# Altium schematic sheet CH579M-R1.SchDoc
size 304 x 228 mm
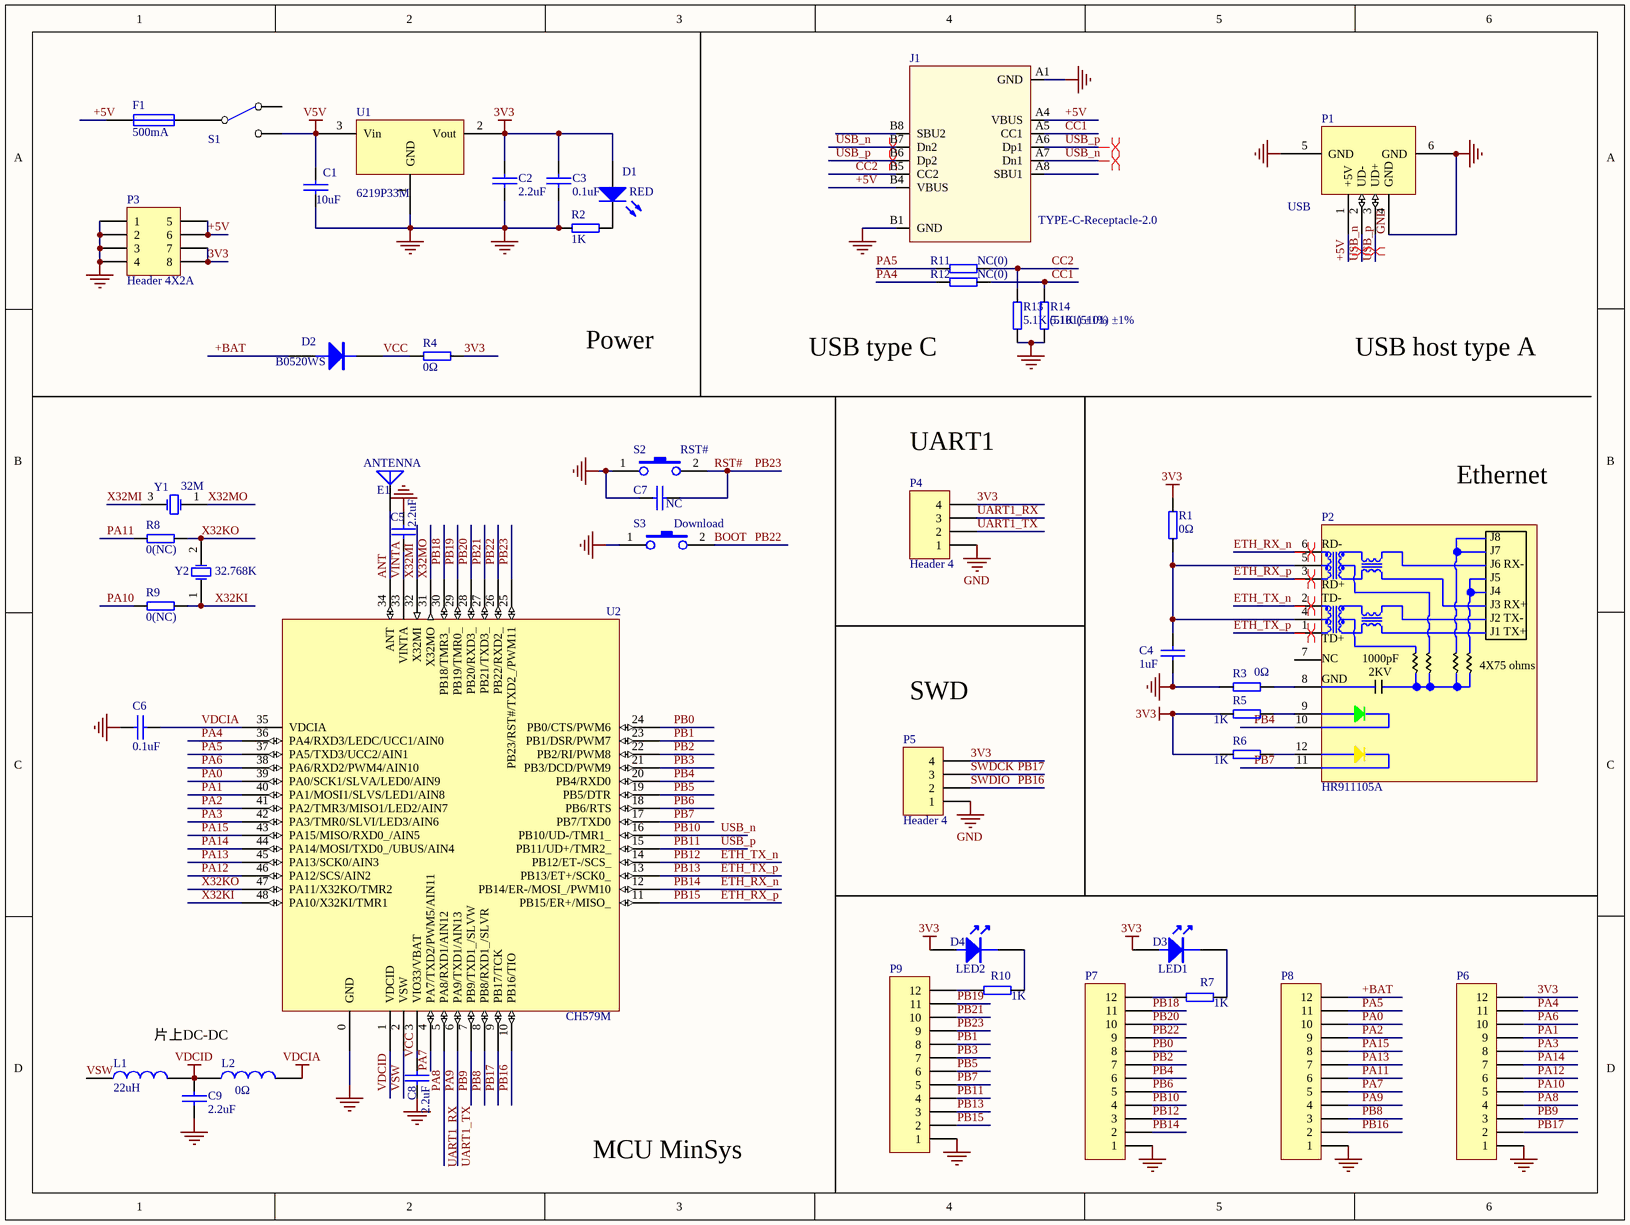
[diagram p0: CH579M-R1.SchDoc]

## Parts
C1  10uF  [3216]
C2  2.2uF  [0603]
C3  0.1uF  [0603]
C4  1uF  [0603]
C5  2.2uF  [0603]
C6  0.1uF  [0603]
C7  NC  [0603]
C8  2.2uF  [0603]
C9  2.2uF  [0603]
D1  RED  [0603+]
D2  B0520WS  [SOD323]
D3  LED1  [0603+]
D4  LED2  [0603+]
E1  ANTENNA  [ANT-F-1-2.4G-1.6]
F1  500mA  [0805]
J1  TYPE-C-Receptacle-2.0  [TYPE-C-Receptacle-2.0]
L1  22uH  [SMD-2.5*2*1.05]
L2  0Ω  [0603]
P1  USB  [USBA-L]
P2  HR911105A  [HR911105A]
P3  Header 4X2A  [IDC8]
P4  Header 4  [HDR1X4]
P5  Header 4  [HDR1X4]
P6  Header 12  [SIP12 - 40mil]  (value not drawn)
P7  Header 12  [SIP12 - 40mil]  (value not drawn)
P8  Header 12  [SIP12 - 40mil]  (value not drawn)
P9  Header 12  [SIP12 - 40mil]  (value not drawn)
R1  0Ω  [0603]
R2  1K  [0603]
R3  0Ω  [0603]
R4  0Ω  [0603]
R5  1K  [0603]
R6  1K  [0603]
R7  1K  [0603]
R8  0(NC)  [0603]
R9  0(NC)  [0603]
R10  1K  [0603]
R11  NC(0)  [0603]
R12  NC(0)  [0603]
R13  5.1K (5101) ±1%  [0603]
R14  5.1K (5101) ±1%  [0603]
S1  SW SPDT  [KEY_B]  (value not drawn)
S2  RST#  [SMD_6.1x3.65x2.5mm-KEY]
S3  Download  [SMD_6.1x3.65x2.5mm-KEY]
U1  6219P33M  [SOT-23]
U2  CH579M  [QFN48_5X5]
Y1  32M  [3225]
Y2  32.768K  [fc-135]

## Nets
3V3: C2.1 C3.1 D1.1(A) D3.1 D4.1 P3.7 P3.8 P4.4 P5.4 P6.12 R1.2 R4.1 R5.1 R6.1 U1.2(Vout)
GND: C1.2 C2.2 C3.2 C4.1 C5.2 C6.2 C7.1 C8.1 C9.1 J1.A1(GND) J1.B1(GND) P1.4(GND) P1.5(GND) P1.6(GND) P3.1 P3.2 P3.3 P3.4 P4.1 P5.1 P6.1 P7.1 P8.1 P9.1 R2.2 R3.1 R13.2 R14.2 S2.1 S3.1 U1.1(GND) U2.0(GND)
V5V: C1.1 S1.2(NC) U1.3(Vin)
VDCIA: C6.1 L2.2 U2.35(VDCIA)
VDCID: C9.2 L1.2 L2.1 U2.1(VDCID)
+5V: F1.1 J1.A4(VBUS) J1.B4(VBUS) P1.1(+5V) P3.5 P3.6
+BAT: D2.1(A) P8.12
ANT: E1.1(A) U2.34(ANT)
BOOT: P7.9 S3.2 U2.26(PB22/RXD2_)  [also labelled PB22]
CC1: J1.A5(CC1) R12.2 R14.1
CC2: J1.B5(CC2) R11.2 R13.1
ETH_RX_n: P2.6 P7.2 U2.12(PB14/ER-/MOSI_/PWM10)  [also labelled PB14]
ETH_RX_p: P2.3 P9.2 U2.11(PB15/ER+/MISO_)  [also labelled PB15]
ETH_TX_n: P2.2 P7.3 U2.14(PB12/ET-/SCS_)  [also labelled PB12]
ETH_TX_p: P2.1 P9.3 U2.13(PB13/ET+/SCK0_)  [also labelled PB13]
PA0: P8.10 U2.39(PA0/SCK1/SLVA/LED0/AIN9)
PA1: P6.9 U2.40(PA1/MOSI1/SLVS/LED1/AIN8)
PA2: P8.9 U2.41(PA2/TMR3/MISO1/LED2/AIN7)
PA3: P6.8 U2.42(PA3/TMR0/SLVI/LED3/AIN6)
PA4: P6.11 R12.1 U2.36(PA4/RXD3/LEDC/UCC1/AIN0)
PA5: P8.11 R11.1 U2.37(PA5/TXD3/UCC2/AIN1)
PA6: P6.10 U2.38(PA6/RXD2/PWM4/AIN10)
PA7: P8.5 U2.4(PA7/TXD2/PWM5/AIN11)
PA8: P4.3 P6.4 U2.5(PA8/RXD1/AIN12)  [also labelled UART1_RX]
PA9: P4.2 P8.4 U2.6(PA9/TXD1/AIN13)  [also labelled UART1_TX]
PA10: P6.5 R9.1
PA11: P8.6 R8.1
PA12: P6.6 U2.46(PA12/SCS/AIN2)
PA13: P8.7 U2.45(PA13/SCK0/AIN3)
PA14: P6.7 U2.44(PA14/MOSI/TXD0_/UBUS/AIN4)
PA15: P8.8 U2.43(PA15/MISO/RXD0_/AIN5)
PB0: P7.8 U2.24(PB0/CTS/PWM6)
PB1: P9.8 U2.23(PB1/DSR/PWM7)
PB2: P7.7 U2.22(PB2/RI/PWM8)
PB3: P9.7 U2.21(PB3/DCD/PWM9)
PB4: P2.10 P7.6 U2.20(PB4/RXD0)
PB5: P9.6 U2.19(PB5/DTR)
PB6: P7.5 U2.18(PB6/RTS)
PB7: P2.11 P9.5 U2.17(PB7/TXD0)
PB8: P8.3 U2.8(PB8/RXD1_/SLVR)
PB9: P6.3 U2.7(PB9/TXD1_/SLVW)
PB10: J1.A7(Dn1) J1.B7(Dn2) P1.2(UD-) P7.4 U2.16(PB10/UD-/TMR1_)  [also labelled USB_n]
PB11: J1.A6(Dp1) J1.B6(Dp2) P1.3(UD+) P9.4 U2.15(PB11/UD+/TMR2_)  [also labelled USB_p]
PB16: P5.2 P8.2 U2.10(PB16/TIO)  [also labelled SWDIO]
PB17: P5.3 P6.2 U2.9(PB17/TCK)  [also labelled SWDCK]
PB18: P7.11 U2.30(PB18/TMR3_)
PB19: P9.11 U2.29(PB19/TMR0_)
PB20: P7.10 U2.28(PB20/RXD3_)
PB21: P9.10 U2.27(PB21/TXD3_)
PB23: C7.2 P9.9 S2.2 U2.25(PB23/RST#/TXD2_/PWM11)  [also labelled RST#]
VCC: C8.2 D2.2(K) R4.2 U2.3(VIO33/VBAT)
VINTA: C5.1 U2.33(VINTA)
VSW: L1.1 U2.2(VSW)
X32KI: R9.2 U2.48(PA10/X32KI/TMR1) Y2.1(OSC1)
X32KO: R8.2 U2.47(PA11/X32KO/TMR2) Y2.2(OSC2)
X32MI: U2.32(X32MI) Y1.3(OSC2)
X32MO: U2.31(X32MO) Y1.1(OSC1)
NetC4_2: C4.2 P2.4 P2.5 R1.1
NetD1_2: D1.2(K) R2.1
NetD3_2: D3.2 R7.2
NetD4_2: D4.2 R10.2
NetF1_2: F1.2 S1.1(COMMON)
NetP2_8: P2.8 R3.2
NetP2_9: P2.9 R5.2
NetP2_12: P2.12 R6.2
NetP7_12: P7.12 R7.1
NetP9_12: P9.12 R10.1

Not connected (* = marked no-connect by the designer): J1 A8(SBU1) B8(SBU2); P2 7; S1 3(NO)

## Layout directives
differential pair: ETH_RX_n, ETH_RX_p, ETH_TX_n, ETH_TX_p, PB10, PB11

## Notes on the sheet
- Power
- USB type C
- USB host type A
- (near P4) UART1
- Ethernet
- SWD
- 片上DC-DC
- MCU MinSys
- (in symbol HR911105A) J8; RD-; J7; J6; RX-; J5; RD+; J4; TD-; J3; RX+; J2; TX-; J1; TX+; TD+; NC; 1000pF; 4X75 ohms; 2KV; GND

## Library data of the parts
C1-C9 = CAP: Capacitor
D1 = LED0: Typical INFRARED GaAs LED; Published: 8-Jun-2000; LatestRevisionDate: 08-Jul-2005; LatestRevisionNote: Mech Layer 1 removed.; PackageReference: LED-0; Publisher: Altium Limited; PackageDescription: LED; 2 Leads
D2 = DIODE
D3 D4 = LED
E1 = ANTENNA: Generic Antenna
F1 = FUSE1: Fuse
J1 = TYPE-C-Receptacle-2.0: Type-C USB2.0 母座
L1 L2 = INDUCTOR
P1 = USB: USB Port
P3 = Header 4X2A: Header, 4-Pin, Dual row; LatestRevisionDate: 17-Jul-2002; LatestRevisionNote: Re-released for DXP Platform.; Publisher: Altium Limited
P4 P5 = Header 4: Header, 4-Pin; LatestRevisionDate: 17-Jul-2002; LatestRevisionNote: Re-released for DXP Platform.; Publisher: Altium Limited
P6-P9 = Header 12: Header, 12-Pin; LatestRevisionDate: 17-Jul-2002; LatestRevisionNote: Re-released for DXP Platform.; Publisher: Altium Limited
R1-R14 = RES
S2 S3 = KEY1
U2 = CH579M: ARM M0 MCU with BLE+Zigbee+Ethernet+USB
Y1 Y2 = XTAL: Crystal Oscillator; Published: 8-Jun-2000; LatestRevisionDate: 17-Jul-2002; LatestRevisionNote: Re-released for DXP Platform.; PackageReference: R38; Publisher: Altium Limited; PackageDescription: Crystal, Thru-Hole; 2 Leads; Body 3.1 x 8.2 mm (Dia.xH)